# Altium schematic sheet Schematics.SchDoc
size 711 x 381 mm; SheetNumber: 1; SheetTotal: 1
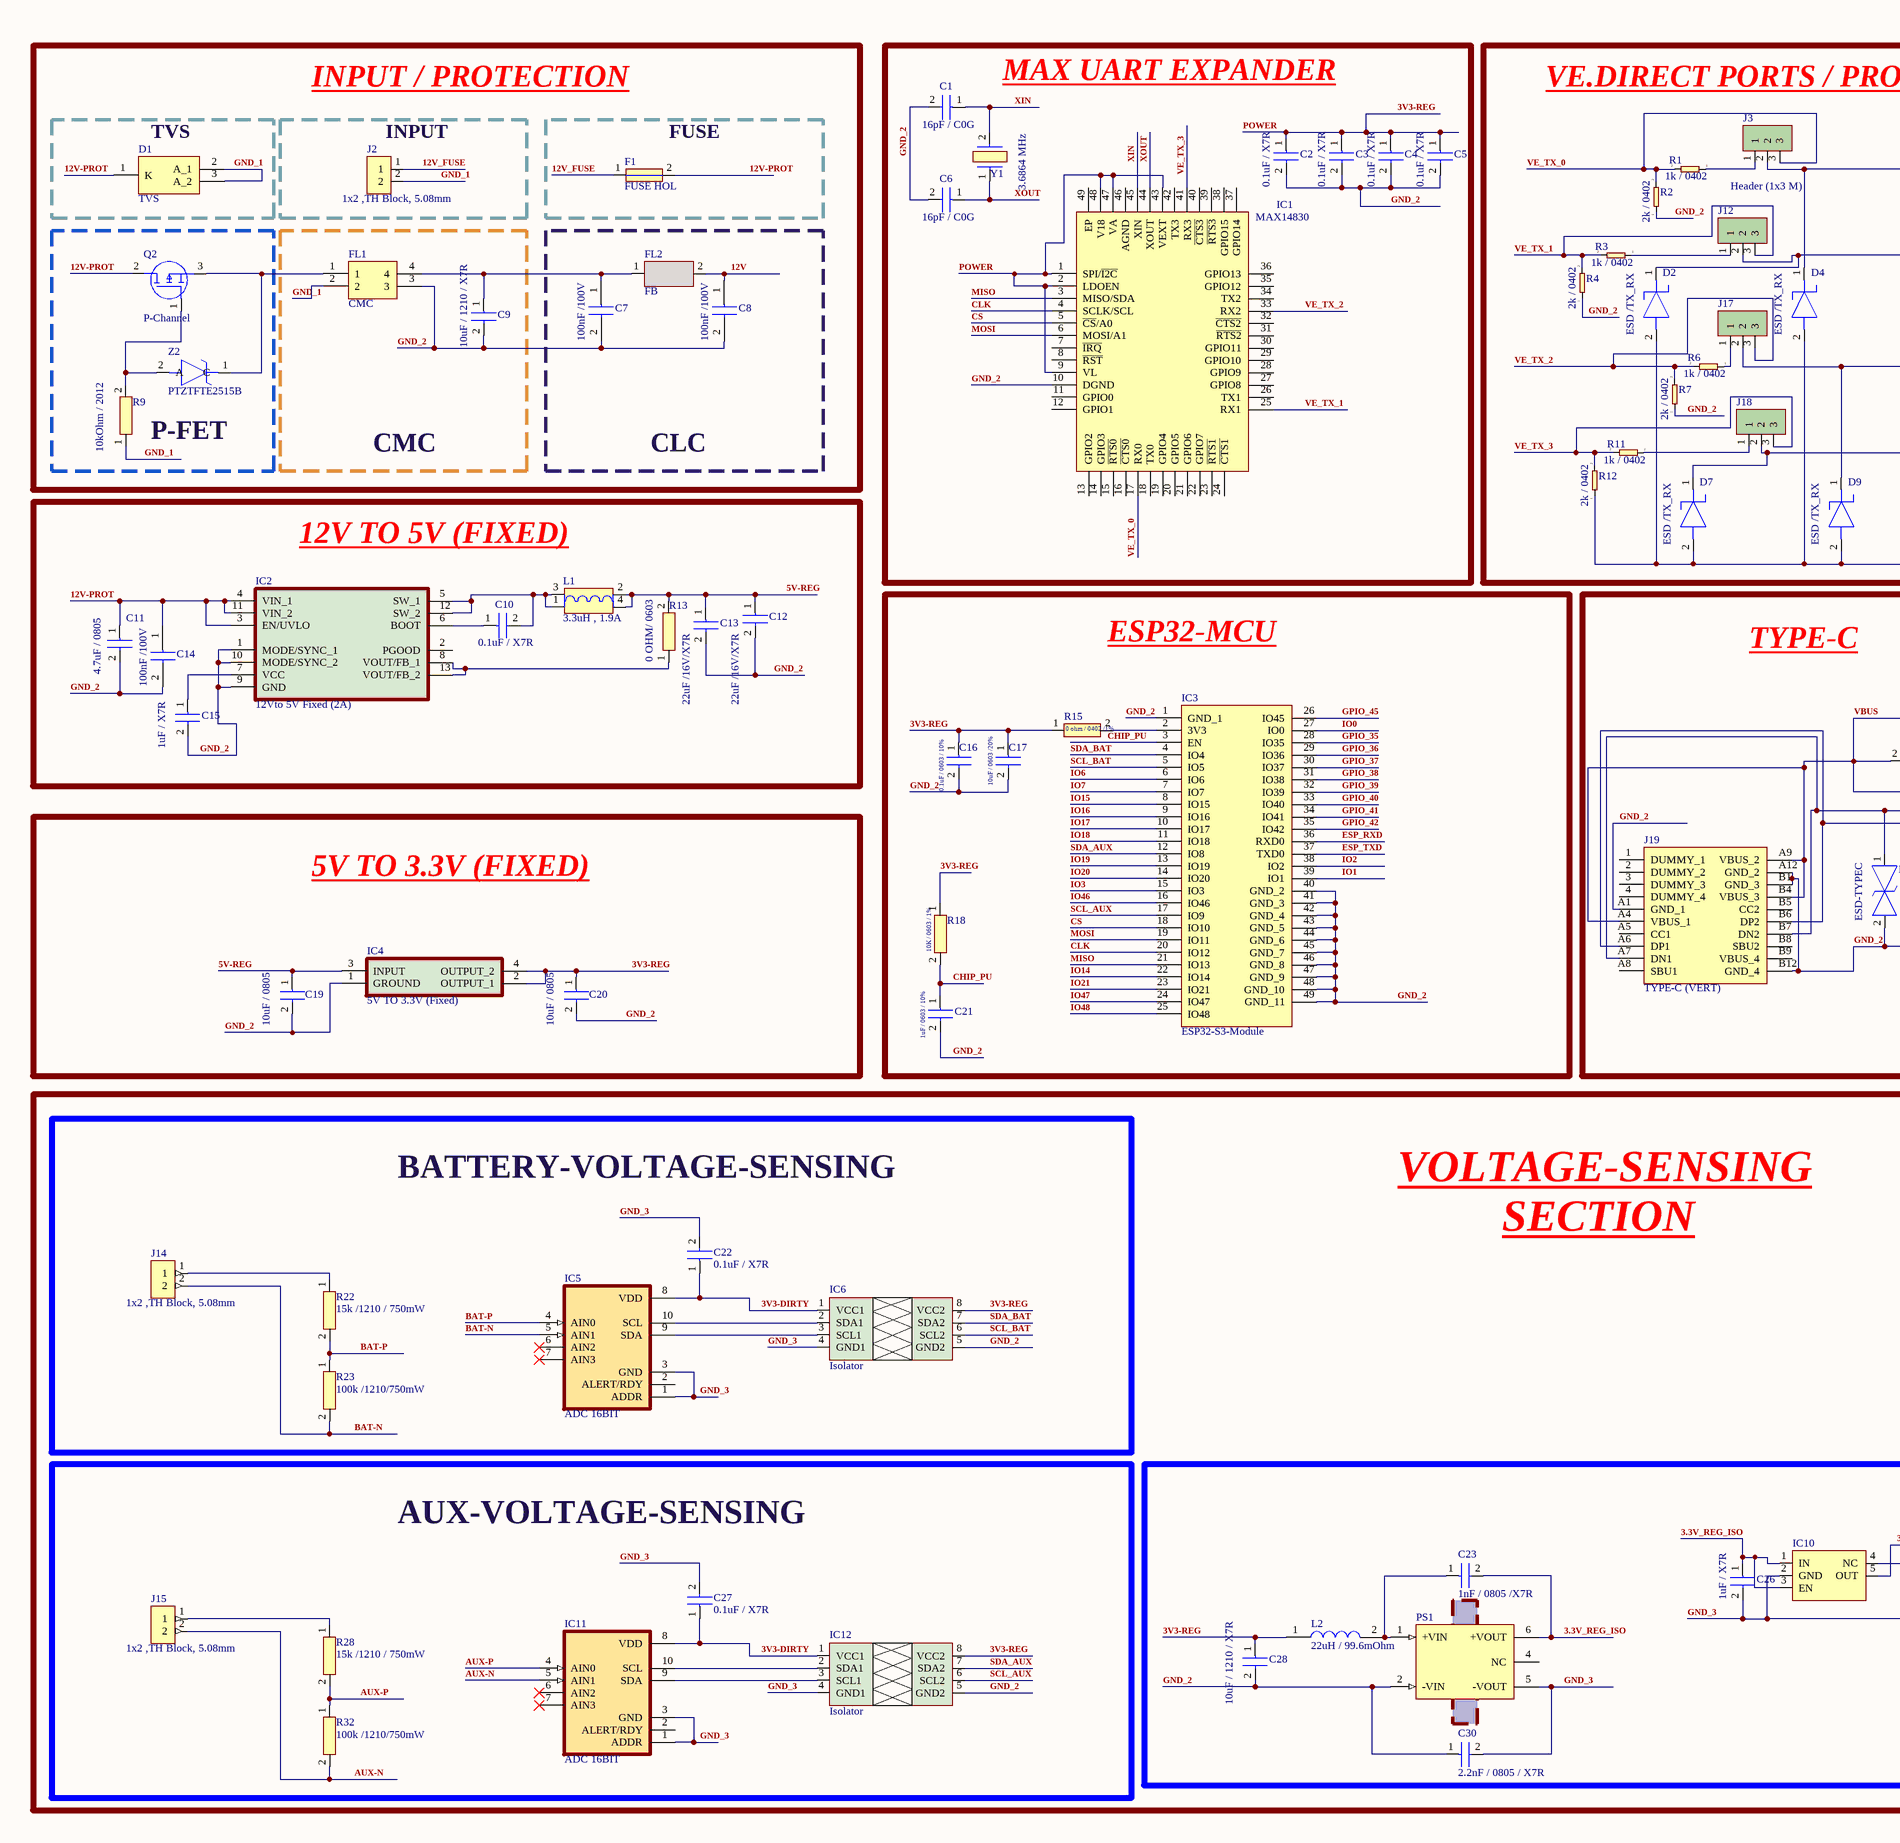
[diagram p0: Schematics.SchDoc, left]
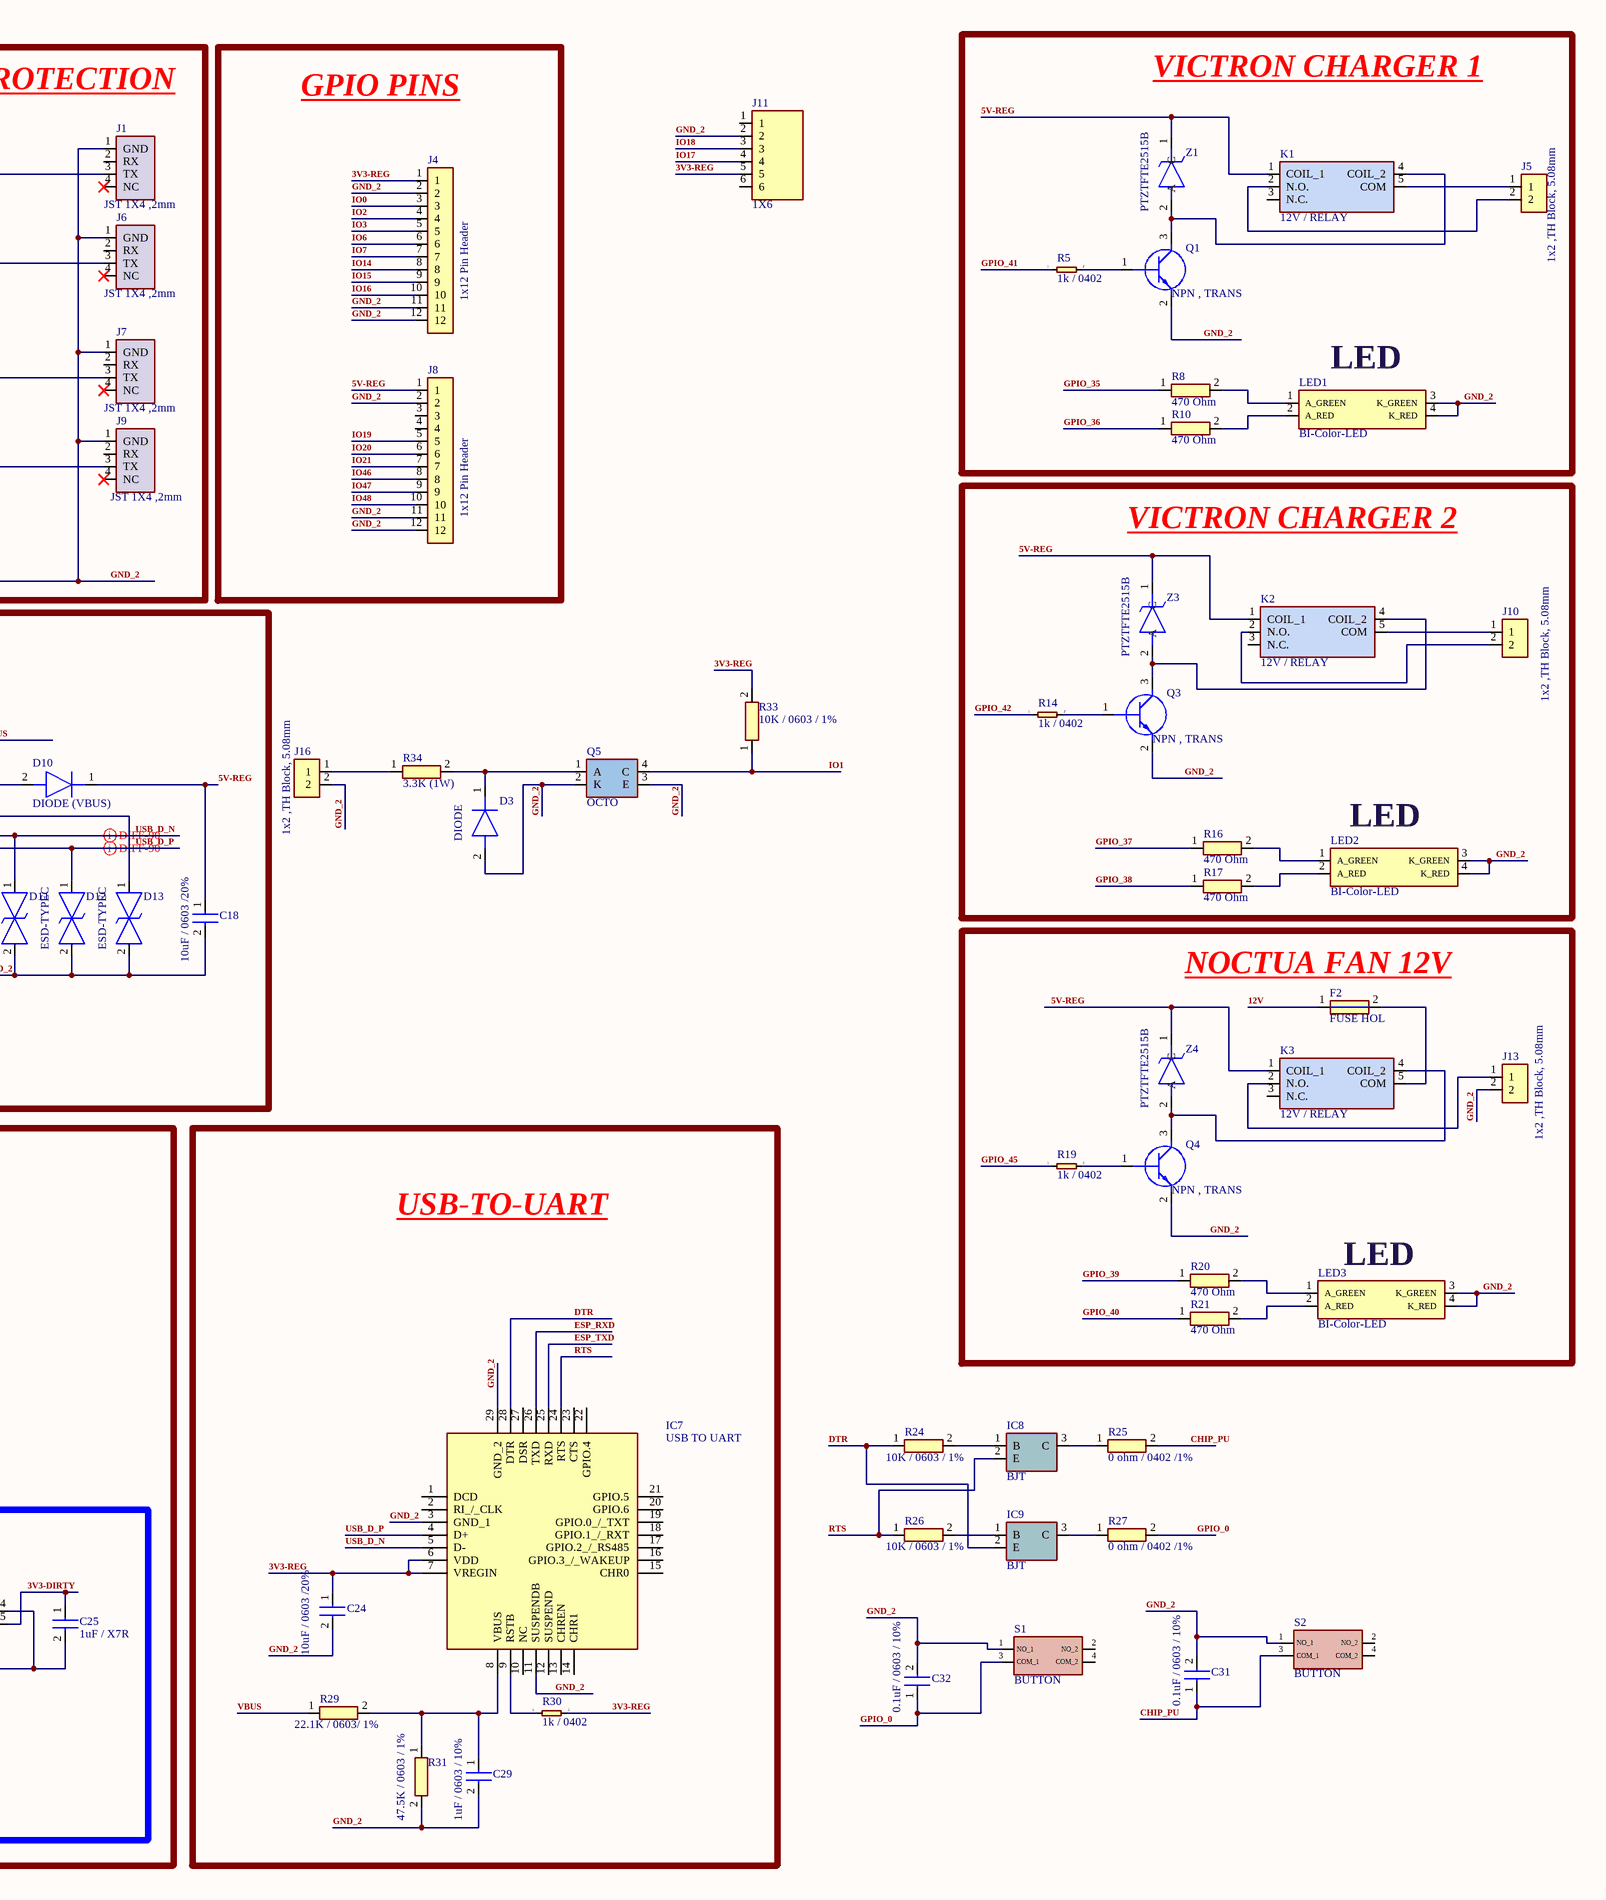
[diagram p1: Schematics.SchDoc, right]

## Parts
C1  16pF / C0G  [GJM1555C1H170JB01J]
C2  0.1uF / X7R  [MAJx16]
C3  0.1uF / X7R  [MAJx16]
C4  0.1uF / X7R  [MAJx16]
C5  0.1uF / X7R  [MAJx16]
C6  16pF / C0G  [GJM1555C1H170JB01J]
C7  100nF /100V  [CAPC1608X87N]
C8  100nF /100V  [CAPC1608X87N]
C9  10uF / 1210 / X7R  [CAPC3225X280N]
C10  0.1uF / X7R  [MAJx16]
C11  4.7uF / 0805  [CGA4J2NP01H223J125AA]
C12  22uF /16V/X7R  [CAPC3225X280N]
C13  22uF /16V/X7R  [CAPC3225X280N]
C14  100nF /100V  [CAPC1608X87N]
C15  1uF / X7R  [CAPC1608X100N]
C16  0.1uF / 0603 / 10%  [CAPC1608X90N]
C17  10uF / 0603 /20%  [CAPC1608X90N]
C18  10uF / 0603 /20%  [CAPC1608X90N]
C19  10uF / 0805  [CGA4J2NP01H223J125AA]
C20  10uF / 0805  [CGA4J2NP01H223J125AA]
C21  1uF / 0603 / 10%  [CAPC1608X90N]
C22  0.1uF / X7R  [MAJx16]
C23  1nF / 0805 /X7R  [C0805]
C24  10uF / 0603 /20%  [CAPC1608X90N]
C25  1uF / X7R  [CAPC1608X100N]
C26  1uF / X7R  [CAPC1608X100N]
C27  0.1uF / X7R  [MAJx16]
C28  10uF / 1210 / X7R  [CAPC3225X280N]
C29  1uF / 0603 / 10%  [CAPC1608X90N]
C30  2.2nF / 0805 / X7R  [C0805]
C31  0.1uF / 0603 / 10%  [CAPC1608X90N]
C32  0.1uF / 0603 / 10%  [CAPC1608X90N]
D1  TVS  [SLD8S36A]
D2  ESD /TX_RX  [PESD5V0S1ULQYL]
D3  DIODE  [SOD3716X125N]
D4  ESD /TX_RX  [PESD5V0S1ULQYL]
D7  ESD /TX_RX  [PESD5V0S1ULQYL]
D9  ESD /TX_RX  [PESD5V0S1ULQYL]
D10  DIODE (VBUS)  [SOD3716X125N]
D11  ESD-TYPEC  [LESD5D50CT1G]
D12  ESD-TYPEC  [LESD5D50CT1G]
D13  ESD-TYPEC  [LESD5D50CT1G]
F1  FUSE HOL  [01530008]
F2  FUSE HOL  [01530008]
FL1  CMC  [ACT45B1012PTL003]
FL2  FB  [BLM31KN102BH1L]
IC1  MAX14830  [QFN50P700X700X80-49N]
IC2  12Vto 5V Fixed (2A)  [LMR43620MC5RPERQ1]
IC3  ESP32-S3-Module  [ESP32S3WROOM1N8R2]
IC4  5V TO 3.3V (Fixed)  [SOT230P700X180-4N]
IC5  ADC 16BIT  [RUG-(R-PQFP-N10)]
IC6  Isolator  [SOIC127P600X175-8N]
IC7  USB TO UART  [QFN50P500X500X80-29N-D]
IC8  BJT  [L8050QLT1G]
IC9  BJT  [L8050QLT1G]
IC10  (no value)  [SOT95P280X145-5N]
IC11  ADC 16BIT  [RUG-(R-PQFP-N10)]
IC12  Isolator  [SOIC127P600X175-8N]
J1  JST 1X4 ,2mm  [SHDR4W50P0X200_1X4_990X600X450P]
J2  1x2 ,TH Block, 5.08mm  [1760510000]
J3  Header (1x3 M)  [HDRV3W63P0X254_1X3_762X250X950P]
J4  1x12 Pin Header  [HDRV12W68P0X254_1X12_3048X250X970P]
J5  1x2 ,TH Block, 5.08mm  [1760510000]
J6  JST 1X4 ,2mm  [SHDR4W50P0X200_1X4_990X600X450P]
J7  JST 1X4 ,2mm  [SHDR4W50P0X200_1X4_990X600X450P]
J8  1x12 Pin Header  [HDRV12W68P0X254_1X12_3048X250X970P]
J9  JST 1X4 ,2mm  [SHDR4W50P0X200_1X4_990X600X450P]
J10  1x2 ,TH Block, 5.08mm  [1760510000]
J11  1X6  [68001206HLF]
J12  Header (1x3 M)  [HDRV3W63P0X254_1X3_762X250X950P]  (value not drawn)
J13  1x2 ,TH Block, 5.08mm  [1760510000]
J14  1x2 ,TH Block, 5.08mm  [1760510000]
J15  1x2 ,TH Block, 5.08mm  [1760510000]
J16  1x2 ,TH Block, 5.08mm  [1760510000]
J17  Header (1x3 M)  [HDRV3W63P0X254_1X3_762X250X950P]  (value not drawn)
J18  Header (1x3 M)  [HDRV3W63P0X254_1X3_762X250X950P]  (value not drawn)
J19  TYPE-C (VERT)  [UJ20CVGSMTP16TR65]
K1  12V / RELAY  [ACQ131]
K2  12V / RELAY  [ACQ131]
K3  12V / RELAY  [ACQ131]
L1  3.3uH , 1.9A  [LQH43MN470K03L]
L2  22uH / 99.6mOhm  [XAL5030]
LED1  BI-Color-LED  [HSMFC163]
LED2  BI-Color-LED  [HSMFC163]
LED3  BI-Color-LED  [HSMFC163]
PS1  (no value)  [CONV_RB-3.33.3S]
Q1  NPN , TRANS  [SOT95P230X110-3N]
Q2  P-Channel  [FQD20N06TM]
Q3  NPN , TRANS  [SOT95P230X110-3N]
Q4  NPN , TRANS  [SOT95P230X110-3N]
Q5  OCTO  [SOP254P1016X436-4N]
R1  1k / 0402  [ERJ2RKD1004X]
R2  2k / 0402  [ERJPA2_(0402)]
R3  1k / 0402  [ERJ2RKD1004X]
R4  2k / 0402  [ERJPA2_(0402)]
R5  1k / 0402  [ERJ2RKD1004X]
R6  1k / 0402  [ERJ2RKD1004X]
R7  2k / 0402  [ERJPA2_(0402)]
R8  470 Ohm  [RESC2012X50N]
R9  10kOhm / 2012  [RESC2012X60N]
R10  470 Ohm  [RESC2012X50N]
R11  1k / 0402  [ERJ2RKD1004X]
R12  2k / 0402  [ERJPA2_(0402)]
R13  0 OHM/ 0603  [RESC1608X55N]
R14  1k / 0402  [ERJ2RKD1004X]
R15  0 ohm / 0402 /1%  [RESC1005X37N]
R16  470 Ohm  [RESC2012X50N]
R17  470 Ohm  [RESC2012X50N]
R18  10K / 0603 / 1%  [ERJP03_PA3_(0603)]
R19  1k / 0402  [ERJ2RKD1004X]
R20  470 Ohm  [RESC2012X50N]
R21  470 Ohm  [RESC2012X50N]
R22  15k /1210 / 750mW  [RESC3225X70N]
R23  100k /1210/750mW  [RESC3225X70N]
R24  10K / 0603 / 1%  [ERJP03_PA3_(0603)]
R25  0 ohm / 0402 /1%  [RESC1005X37N]
R26  10K / 0603 / 1%  [ERJP03_PA3_(0603)]
R27  0 ohm / 0402 /1%  [RESC1005X37N]
R28  15k /1210 / 750mW  [RESC3225X70N]
R29  22.1K / 0603/ 1%  [ERJP03_PA3_(0603)]
R30  1k / 0402  [ERJ2RKD1004X]
R31  47.5K / 0603 / 1%  [ERJ1GJJ2R4C]
R32  100k /1210/750mW  [RESC3225X70N]
R33  10K / 0603 / 1%  [ERJP03_PA3_(0603)]
R34  3.3K (1W)  [RESC2550X65N]
S1  BUTTON  [NTC013AT1JA160T]
S2  BUTTON  [NTC013AT1JA160T]
Y1  3.6864 MHz  [830030798]
Z1  PTZTFTE2515B  [PTZTFTE2515B]
Z2  PTZTFTE2515B  [PTZTFTE2515B]
Z3  PTZTFTE2515B  [PTZTFTE2515B]
Z4  PTZTFTE2515B  [PTZTFTE2515B]

## Blocks framed on the sheet
LED: J5 K1 LED1 Q1 R5 R8 R10 Z1
MAX UART EXPANDER: C1-C6 IC1 Y1
VE.DIRECT PORTS / PROTECTION: D2 D4 D7 D9 J1 J3 J6 J7 J9 J12 J17 J18 R1-R4 R6 R7 R11 R12
GPIO PINS: J4 J8
TVS: D1
INPUT: J2
FUSE: F1
P-FET: Q2 R9 Z2
CMC: C9 FL1
CLC: C7 C8 FL2
LED: J10 K2 LED2 Q3 R14 R16 R17 Z3
12V TO 5V (FIXED): C10-C15 IC2 L1 R13
ESP32-MCU: C16 C17 C21 IC3 R15 R18
TYPE-C: C18 D10-D13 J19
5V TO 3.3V (FIXED): C19 C20 IC4
LED: F2 J13 K3 LED3 Q4 R19-R21 Z4
BATTERY-VOLTAGE-SENSING: C22 IC5 IC6 J14 R22 R23
USB-TO-UART: C24 C29 IC7 R29-R31
AUX-VOLTAGE-SENSING: C27 IC11 IC12 J15 R28 R32

## Nets
3.3V_REG_ISO: C23.2 C26.1 IC10.1(IN) IC10.3(EN) PS1.6(+VOUT)
3V3-DIRTY: C22.1 C25.1 C27.1 IC5.8(VDD) IC6.1(VCC1) IC10.5(OUT) IC11.8(VDD) IC12.1(VCC1)
3V3-REG: C2.1 C3.1 C4.1 C5.1 C16.1 C17.1 C20.1 C24.1 C28.1 IC1.1(SPI/~{I2C}) IC1.2(LDOEN) IC1.9(VL) IC1.43(VEXT) IC1.47(VA) IC1.48(V18) IC4.2(OUTPUT_1) IC4.4(OUTPUT_2) IC6.8(VCC2) IC7.6(VDD) IC7.7(VREGIN) IC12.8(VCC2) J4.1 J11.5 L2.1 R15.1 R18.1 R30.2 R33.2  [also labelled POWER]
5V-REG: C12.1 C13.1 C18.1 C19.1 D10.1(K) IC4.3(INPUT) J8.1 K1.1(COIL_1) K2.1(COIL_1) K3.1(COIL_1) L1.2 L1.4 R13.2 Z1.1(C) Z3.1(C) Z4.1(C)
12V: C8.1 F2.1 FL2.2
12V-PROT: C11.1 C14.1 D1.1(K) F1.2 IC2.3(EN/UVLO) IC2.4(VIN_1) IC2.11(VIN_2) Q2.2(D)
12V_FUSE: F1.1 J2.1
AUX-N: IC11.5(AIN1) J15.2 R32.2
AUX-P: IC11.4(AIN0) R28.2 R32.1
BAT-N: IC5.5(AIN1) J14.2 R23.2
BAT-P: IC5.4(AIN0) R22.2 R23.1
CHIP_PU: C21.1 C31.1 IC3.3(EN) R18.2 R25.2 S2.3(COM_1)
CLK: IC1.4(SCLK/SCL) IC3.20(IO12)
CS: IC1.5(~{CS}/A0) IC3.18(IO10)
DTR: IC7.28(DTR) IC9.2(E) R24.1
ESP_RXD: IC3.36(RXD0) IC7.26(TXD)
ESP_TXD: IC3.37(TXD0) IC7.25(RXD)
GND_1: D1.2(A_1) D1.3(A_2) FL1.2 J2.2 R9.1
GND_2: C1.2 C2.2 C3.2 C4.2 C5.2 C6.2 C7.2 C8.2 C9.2 C11.2 C12.2 C13.2 C14.2 C15.2 C16.2 C17.2 C18.2 C19.2 C20.2 C21.2 C24.2 C28.2 C29.2 C30.1 C31.2 C32.2 D2.2(A) D3.2(A) D4.2(A) D7.2(A) D9.2(A) D11.2 D12.2 D13.2 FL1.3 IC1.10(DGND) IC2.1(MODE/SYNC_1) IC2.9(GND) IC2.10(MODE/SYNC_2) IC3.1(GND_1) IC3.40(GND_2) IC3.41(GND_3) IC3.42(GND_4) IC3.43(GND_5) IC3.44(GND_6) IC3.45(GND_7) IC3.46(GND_8) IC3.47(GND_9) IC3.48(GND_10) IC3.49(GND_11) IC4.1(GROUND) IC6.5(GND2) IC7.3(GND_1) IC7.11(SUSPENDB) IC7.29(GND_2) IC12.5(GND2) J1.1(GND) J4.2 J4.11 J4.12 J6.1(GND) J7.1(GND) J8.2 J8.11 J8.12 J9.1(GND) J11.2 J13.2 J16.2 J19.A1(GND_1) J19.A12(GND_2) J19.B1(GND_3) J19.B12(GND_4) LED1.3(K_GREEN) LED1.4(K_RED) LED2.3(K_GREEN) LED2.4(K_RED) LED3.3(K_GREEN) LED3.4(K_RED) PS1.2(-VIN) Q1.2(E) Q3.2(E) Q4.2(E) Q5.2(K) Q5.3(E) R2.1 R4.1 R7.1 R12.1 R31.2 S1.1(NO_1) S2.1(NO_1)
GND_3: C22.2 C25.2 C26.2 C27.2 C30.2 IC5.1(ADDR) IC5.3(GND) IC6.4(GND1) IC10.2(GND) IC10.4(NC) IC11.1(ADDR) IC11.3(GND) IC12.4(GND1) PS1.5(-VOUT)
GPIO_0: C32.1 R27.2 S1.3(COM_1)
GPIO_35: IC3.28(IO35) R8.1
GPIO_36: IC3.29(IO36) R10.1
GPIO_37: IC3.30(IO37) R16.1
GPIO_38: IC3.31(IO38) R17.1
GPIO_39: IC3.32(IO39) R20.1
GPIO_40: IC3.33(IO40) R21.1
GPIO_41: IC3.34(IO41) R5.1
GPIO_42: IC3.35(IO42) R14.1
GPIO_45: IC3.26(IO45) R19.1
IO0: IC3.27(IO0) J4.3
IO1: IC3.39(IO1) Q5.4(C) R33.1
IO2: IC3.38(IO2) J4.4
IO3: IC3.15(IO3) J4.5
IO6: IC3.6(IO6) J4.6
IO7: IC3.7(IO7) J4.7
IO14: IC3.22(IO14) J4.8
IO15: IC3.8(IO15) J4.9
IO16: IC3.9(IO16) J4.10
IO17: IC3.10(IO17) J11.4
IO18: IC3.11(IO18) J11.3
IO19: IC3.13(IO19) J8.5
IO20: IC3.14(IO20) J8.6
IO21: IC3.23(IO21) J8.7
IO46: IC3.16(IO46) J8.8
IO47: IC3.24(IO47) J8.9
IO48: IC3.25(IO48) J8.10
MISO: IC1.3(MISO/SDA) IC3.21(IO13)
MOSI: IC1.6(MOSI/A1) IC3.19(IO11)
RTS: IC7.24(RTS) IC8.2(E) R26.1
SCL_AUX: IC3.17(IO9) IC12.6(SCL2)
SCL_BAT: IC3.5(IO5) IC6.6(SCL2)
SDA_AUX: IC3.12(IO8) IC12.7(SDA2)
SDA_BAT: IC3.4(IO4) IC6.7(SDA2)
USB_D_N: D11.1 IC7.5(D-) J19.A7(DN1) J19.B7(DN2)
USB_D_P: D12.1 IC7.4(D+) J19.A6(DP1) J19.B6(DP2)
VBUS: D10.2(A) D13.1 J19.A4(VBUS_1) J19.A9(VBUS_2) J19.B4(VBUS_3) R29.1
VE_TX_0: IC1.17(RX0) J3.3 R1.2 R2.2
VE_TX_1: IC1.25(RX1) J12.3 R3.2 R4.2
VE_TX_2: IC1.33(RX2) J17.3 R6.2 R7.2
VE_TX_3: IC1.41(RX3) J18.3 R11.2 R12.2
XIN: C1.1 IC1.45(XIN) Y1.2
XOUT: C6.1 IC1.44(XOUT) Y1.1
NetC7_1: C7.1 C9.1 FL1.4 FL2.1
NetC10_1: C10.1 IC2.6(BOOT)
NetC10_2: C10.2 IC2.5(SW_1) IC2.12(SW_2) L1.1 L1.3
NetC15_1: C15.1 IC2.7(VCC)
NetC23_1: C23.1 L2.2 PS1.1(+VIN)
NetC29_1: C29.1 IC7.8(VBUS) R29.2 R31.1
NetD2_1: D2.1(K) J6.3(TX) J12.2
NetD3_1: D3.1(K) Q5.1(A) R34.2
NetD4_1: D4.1(K) J1.3(TX) J3.2
NetD7_1: D7.1(K) J9.3(TX) J18.2
NetD9_1: D9.1(K) J7.3(TX) J17.2
NetF2_2: F2.2 K3.5(COM)
NetFL1_1: FL1.1 Q2.3(S) Z2.1(C)
NetIC2_8: IC2.8(VOUT/FB_1) IC2.13(VOUT/FB_2) R13.1
NetIC3_2: IC3.2(3V3) R15.2
NetIC5_9: IC5.9(SDA) IC6.3(SCL1)
NetIC5_10: IC5.10(SCL) IC6.2(SDA1)
NetIC7_9: IC7.9(RSTB) R30.1
NetIC8_1: IC8.1(B) R24.2
NetIC8_3: IC8.3(C) R25.1
NetIC9_1: IC9.1(B) R26.2
NetIC9_3: IC9.3(C) R27.1
NetIC11_9: IC11.9(SDA) IC12.3(SCL1)
NetIC11_10: IC11.10(SCL) IC12.2(SDA1)
NetJ3_1: J3.1 R1.1
NetJ5_1: J5.1 K1.5(COM)
NetJ5_2: J5.2 K1.2(N.O.)
NetJ10_1: J10.1 K2.5(COM)
NetJ10_2: J10.2 K2.2(N.O.)
NetJ12_1: J12.1 R3.1
NetJ13_1: J13.1 K3.2(N.O.)
NetJ14_1: J14.1 R22.1
NetJ15_1: J15.1 R28.1
NetJ16_1: J16.1 R34.1
NetJ17_1: J17.1 R6.1
NetJ18_1: J18.1 R11.1
NetK1_4: K1.4(COIL_2) Q1.3(C) Z1.2(A)
NetK2_4: K2.4(COIL_2) Q3.3(C) Z3.2(A)
NetK3_4: K3.4(COIL_2) Q4.3(C) Z4.2(A)
NetLED1_1: LED1.1(A_GREEN) R8.2
NetLED1_2: LED1.2(A_RED) R10.2
NetLED2_1: LED2.1(A_GREEN) R16.2
NetLED2_2: LED2.2(A_RED) R17.2
NetLED3_1: LED3.1(A_GREEN) R20.2
NetLED3_2: LED3.2(A_RED) R21.2
NetQ1_1: Q1.1(B) R5.2
NetQ2_1: Q2.1(G) R9.2 Z2.2(A)
NetQ3_1: Q3.1(B) R14.2
NetQ4_1: Q4.1(B) R19.2

Not connected (* = marked no-connect by the designer): IC1 7(~{IRQ}) 8(~{RST}) 11(GPIO0) 12(GPIO1) 13(GPIO2) 14(GPIO3) 15(~{RTS0}) 16(~{CTS0}) 18(TX0) 19(GPIO4) 20(GPIO5) 21(GPIO6) 22(GPIO7) 23(~{RTS1}) 24(~{CTS1}) 26(TX1) 27(GPIO8) 28(GPIO9) 29(GPIO10) 30(GPIO11) 31(~{RTS2}) 32(~{CTS2}) 34(TX2) 35(GPIO12) 36(GPIO13) 37(GPIO14) 38(GPIO15) 39(~{RTS3}) 40(~{CTS3}) 42(TX3) 46(AGND) 49(EP); IC2 2(PGOOD); IC5 2(ALERT/RDY) 6(AIN2)* 7(AIN3)*; IC7 1(DCD) 2(RI_/_CLK) 10(NC) 12(SUSPEND) 13(CHREN) 14(CHR1) 15(CHR0) 16(GPIO.3_/_WAKEUP) 17(GPIO.2_/_RS485) 18(GPIO.1_/_RXT) 19(GPIO.0_/_TXT) 20(GPIO.6) 21(GPIO.5) 22(GPIO.4) 23(CTS) 27(DSR); IC11 2(ALERT/RDY) 6(AIN2)* 7(AIN3)*; J1 2(RX) 4(NC)*; J6 2(RX) 4(NC)*; J7 2(RX) 4(NC)*; J8 3 4; J9 2(RX) 4(NC)*; J11 1 6; J19 1(DUMMY_1) 2(DUMMY_2) 3(DUMMY_3) 4(DUMMY_4) A5(CC1) A8(SBU1) B5(CC2) B8(SBU2) B9(VBUS_4); K1 3(N.C.); K2 3(N.C.); K3 3(N.C.); PS1 4(NC); S1 2(NO_2) 4(COM_2); S2 2(NO_2) 4(COM_2)

## Layout directives
differential pair; differential pair class 90-OHM: USB_D_N, USB_D_P

## Notes on the sheet
- VICTRON CHARGER 1
- INPUT / PROTECTION
- VICTRON CHARGER 2
- (near F2) NOCTUA FAN 12V
- VOLTAGE-SENSING
- SECTION

## Library data of the parts
C1 C6 = GJM1555C1H160FB01J: Capacitor; Manufacturer_Name: Murata Electronics; Datasheet Link: https://search.murata.co.jp/Ceramy/image/img/A01X/G101/ENG/GJM1555C1H160FB01-01A.pdf; Height: 0.55mm; Manufacturer_Part_Number: GJM1555C1H160FB01J; Mouser Part Number: 81-GJM1555C1H160FB1J; Mouser Price/Stock: https://www.mouser.co.uk/ProductDetail/Murata-Electronics/GJM1555C1H160FB01J?qs=QzBtWTOodeWJ9M0Fp%2F2Qlw%3D%3D
C2-C5 C10 C22 C27 = MAJCU168BB7104KTEA01: Capacitor; Manufacturer_Name: TAIYO YUDEN; Datasheet Link: https://ds.yuden.co.jp/TYCOMPAS/or/detail?pn=MAJCU168BB7104KTEA01; Height: 0.8mm; Manufacturer_Part_Number: MAJCU168BB7104KTEA01
C7 C8 C14 = C0603C104J1RACAUTO7411: Multilayer Ceramic Capacitors MLCC - SMD/SMT 100V 100000pF 5% X7R 1608 AEC-Q200; Manufacturer_Name: KEMET; Datasheet Link: https://cz.mouser.com/datasheet/2/447/KEM_C1023_X7R_AUTO_SMD-3316698.pdf; Height: 0.87mm; Manufacturer_Part_Number: C0603C104J1RACAUTO7411; Mouser Part Number: 80-C0603C104J1RAUTO7; Mouser Price/Stock: https://www.mouser.co.uk/ProductDetail/KEMET/C0603C104J1RACAUTO7411?qs=ulEaXIWI0c%252BJFv1YOR%252BSZg%3D%3D
C9 C28 = CGA6P1X7R2A106K250AC: Capacitor; Manufacturer_Name: TDK; Datasheet Link: https://product.tdk.com/info/en/catalog/datasheets/mlcc_automotive_general_en.pdf; Height: 2.8mm; Manufacturer_Part_Number: CGA6P1X7R2A106K250AC
C11 = CGA4J3X7R1C475K125AE: Capacitor; Manufacturer_Name: TDK; Datasheet Link: http://docs-europe.electrocomponents.com/webdocs/14e9/0900766b814e9125.pdf; Height: 1.45mm; Manufacturer_Part_Number: CGA4J3X7R1C475K125AE; Mouser Part Number: 810-CGA4J3X7R1C475KS; Mouser Price/Stock: https://www.mouser.co.uk/ProductDetail/TDK/CGA4J3X7R1C475K125AE?qs=FxQuwy19cyADXX788CagRA%3D%3D; Arrow Part Number: CGA4J3X7R1C475K125AE; Arrow Price/Stock: https://www.arrow.com/en/products/cga4j3x7r1c475k125ae/tdk
C12 C13 = CGA6P1X7R1C226M250AC: Capacitor; Manufacturer_Name: TDK; Datasheet Link: https://product.tdk.com/system/files/dam/doc/product/capacitor/ceramic/mlcc/catalog/mlcc_automotive_general_en.pdf; Height: 2.8mm; Manufacturer_Part_Number: CGA6P1X7R1C226M250AC; Mouser Part Number: 810-CGA6P1X7R1C226M; Mouser Price/Stock: https://www.mouser.co.uk/ProductDetail/TDK/CGA6P1X7R1C226M250AC?qs=NRhsANhppD%2FAe7owpb9Z2A%3D%3D; Arrow Part Number: CGA6P1X7R1C226M250AC; Arrow Price/Stock: https://www.arrow.com/en/products/cga6p1x7r1c226m250ac/tdk
C15 C25 C26 = CL10B105KB9VPNC: Capacitor; Manufacturer_Name: SAMSUNG; Datasheet Link: https://www.mouser.com/datasheet/2/585/MLCC_Automotive-1837966.pdf; Height: 1mm; Manufacturer_Part_Number: CL10B105KB9VPNC; Mouser Part Number: 187-CL10B105KB9VPNC; Mouser Price/Stock: https://www.mouser.co.uk/ProductDetail/Samsung-Electro-Mechanics/CL10B105KB9VPNC?qs=3Rah4i%252BhyCFE9VrNkitckQ%3D%3D
C16 C31 C32 = CGA3E2X7R1E104K080AA: Multilayer Ceramic Capacitors MLCC - SMD/SMT CGA 0603 25V 0.1uF X7R 10% AEC-Q200; Manufacturer_Name: TDK; Datasheet Link: http://docs-europe.electrocomponents.com/webdocs/14e9/0900766b814e9125.pdf; Height: 0.9mm; Manufacturer_Part_Number: CGA3E2X7R1E104K080AA; Mouser Part Number: 810-CGA3E2X7R1E104K; Mouser Price/Stock: https://www.mouser.co.uk/ProductDetail/TDK/CGA3E2X7R1E104K080AA?qs=NRhsANhppD%2Fm7%2FOmmsm0vg%3D%3D; Arrow Part Number: CGA3E2X7R1E104K080AA; Arrow Price/Stock: https://www.arrow.com/en/products/cga3e2x7r1e104k080aa/tdk?utm_currency=USD&region=nac
C17 C18 C24 = GRT188R61E106ME13D: Multilayer Ceramic Capacitors MLCC - SMD/SMT 10 uF 25 VDC 20% 0603 X5R AEC-Q200; Manufacturer_Name: Murata Electronics; Datasheet Link: https://search.murata.co.jp/Ceramy/image/img/A01X/G101/ENG/GRT188R61E106ME13-01A.pdf; Height: 0.9mm; Manufacturer_Part_Number: GRT188R61E106ME13D; Mouser Part Number: 81-GRT188R61E106ME3D; Mouser Price/Stock: https://www.mouser.co.uk/ProductDetail/Murata-Electronics/GRT188R61E106ME13D?qs=drgMNd%252BkGPNNTFaFP8SYQA%3D%3D; Arrow Part Number: GRT188R61E106ME13D; Arrow Price/Stock: https://www.arrow.com/en/products/grt188r61e106me13d/murata-manufacturing?region=nac
C19 C20 = CGA4J1X7S1C106M125AE: Capacitor; Manufacturer_Name: TDK; Datasheet Link: http://docs-europe.electrocomponents.com/webdocs/14e9/0900766b814e9125.pdf; Height: 1.45mm; Manufacturer_Part_Number: CGA4J1X7S1C106M125AE; Mouser Part Number: 810-CGA4J1X7S1C106MA; Mouser Price/Stock: https://www.mouser.co.uk/ProductDetail/TDK/CGA4J1X7S1C106M125AE?qs=nQSIdc08i%252BcCPp0JpxJc5Q%3D%3D; Arrow Part Number: CGA4J1X7S1C106M125AE; Arrow Price/Stock: https://www.arrow.com/en/products/cga4j1x7s1c106m125ae/tdk?utm_currency=USD&region=nac
C21 C29 = CGA3E1X7R1E105K080AE: Multilayer Ceramic Capacitors MLCC - SMD/SMT SOFT 0603 25V 1uF X7R 10% AEC-Q200; Manufacturer_Name: TDK; Datasheet Link: http://docs-europe.electrocomponents.com/webdocs/14e9/0900766b814e9125.pdf; Height: 0.9mm; Manufacturer_Part_Number: CGA3E1X7R1E105K080AE; Mouser Part Number: 810-CGA3E1X7R1E105KA; Mouser Price/Stock: https://www.mouser.co.uk/ProductDetail/TDK/CGA3E1X7R1E105K080AE?qs=nQSIdc08i%252Bcymysfik8KxA%3D%3D; Arrow Part Number: CGA3E1X7R1E105K080AE; Arrow Price/Stock: https://www.arrow.com/en/products/cga3e1x7r1e105k080ae/tdk
C23 = C0805J222K1RACAUTO_1: Multilayer Ceramic Capacitors MLCC - SMD/SMT 100V 1000pF X7R 0805 20% AEC-Q200; Manufacturer_Name: KEMET; Datasheet Link: https://content.kemet.com/datasheets/KEM_C1012_X7R_OPENMODE_SMD.pdf; Height: 1.1mm; Manufacturer_Part_Number: C0805J222K1RACAUTO; Mouser Part Number: 80-C0805J222K1RAUTO; Mouser Price/Stock: https://www.mouser.co.uk/ProductDetail/KEMET/C0805J222K1RACAUTO?qs=ds50AKTGxA8FpM89MhHcBQ%3D%3D
C30 = C0805J222K1RACAUTO: Multilayer Ceramic Capacitors MLCC - SMD/SMT 100V 2200pF X7R 0805 10% AEC-Q200; Manufacturer_Name: KEMET; Datasheet Link: https://content.kemet.com/datasheets/KEM_C1012_X7R_OPENMODE_SMD.pdf; Height: 1.1mm; Manufacturer_Part_Number: C0805J222K1RACAUTO; Mouser Part Number: 80-C0805J222K1RAUTO; Mouser Price/Stock: https://www.mouser.co.uk/ProductDetail/KEMET/C0805J222K1RACAUTO?qs=ds50AKTGxA8FpM89MhHcBQ%3D%3D
D1 = SLD8S36A: TVS Diode (Uni-directional); Manufacturer_Name: LITTELFUSE; Datasheet Link: https://datasheet.datasheetarchive.com/originals/distributors/DKDS41/DSANUWW0026090.pdf; Height: 4.78mm; Manufacturer_Part_Number: SLD8S36A; Mouser Part Number: 576-SLD8S36A; Mouser Price/Stock: https://www.mouser.co.uk/ProductDetail/Littelfuse/SLD8S36A?qs=CoLE6mUHV0srESI5Dw%2FcKA%3D%3D; Arrow Part Number: SLD8S36A; Arrow Price/Stock: https://www.arrow.com/en/products/sld8s36a/littelfuse?region=nac
D2 D4 D7 D9 = PESD5V0S1UL-QYL: Diode ESD (Uni-directional); Manufacturer_Name: Nexperia; Datasheet Link: https://www.digikey.com/en/products/detail/nexperia-usa-inc/PESD5V0S1UL-QYL/17748204?msockid=3bdc366bbe0663d83c1223c0bf3662a6; Height: 0.5mm; Manufacturer_Part_Number: PESD5V0S1UL-QYL; Mouser Part Number: 771-PESD5V0S1UL-QYL; Mouser Price/Stock: https://www.mouser.co.uk/ProductDetail/Nexperia/PESD5V0S1UL-QYL?qs=rQFj71Wb1eWaKKPWHDNuZA%3D%3D; Arrow Part Number: PESD5V0S1UL-QYL; Arrow Price/Stock: https://www.arrow.com/en/products/pesd5v0s1ul-qyl/nexperia?utm_currency=USD&region=nac
D3 = 1N5819HW-7-F: Manufacturer_Name: Multicomp Pro; Datasheet Link: http://www.farnell.com/datasheets/1693720.pdf; Height: 1.25mm; Manufacturer_Part_Number: 1N5819HW-7-F
D10 = 1N5819HW-7-F: Diode; Manufacturer_Name: Multicomp Pro; Datasheet Link: http://www.farnell.com/datasheets/1693720.pdf; Height: 1.25mm; Manufacturer_Part_Number: 1N5819HW-7-F
D11-D13 = LESD5D5.0CT1G: TVS Diode (Bi-directional); Manufacturer_Name: LRC; Height: 0.7mm; Manufacturer_Part_Number: LESD5D5.0CT1G
F1 F2 = 01530008Z: Fuse Holder 15 A 32V 1 Circuit Blade Through Hole; Manufacturer_Name: LITTELFUSE; Datasheet Link: http://www.littelfuse.com/data/en/data_sheets/153_pcmount.pdf; Manufacturer_Part_Number: 01530008Z; Mouser Part Number: 576-01530008Z; Mouser Price/Stock: https://www.mouser.co.uk/ProductDetail/Littelfuse/01530008Z?qs=gu7KAQ731UQHzmSA1Of2BQ%3D%3D; Arrow Part Number: 01530008Z; Arrow Price/Stock: https://www.arrow.com/en/products/01530008z/littelfuse?utm_currency=USD&region=europe
FL1 = ACT45B-510-2P-TL003: Filter; Manufacturer_Name: TDK; Datasheet Link: https://product.tdk.com/system/files/dam/doc/product/emc/emc/cmf_cmc/catalog/cmf_automotive_signal_act45b_en.pdf; Height: 3mm; Manufacturer_Part_Number: ACT45B-510-2P-TL003; Mouser Part Number: 810-ACT45B5102PTL003; Mouser Price/Stock: https://www.mouser.co.uk/ProductDetail/TDK/ACT45B-510-2P-TL003?qs=U1cgCdF9Le9LCroNYLqljw%3D%3D; Arrow Part Number: ACT45B-510-2P-TL003; Arrow Price/Stock: https://www.arrow.com/en/products/act45b-510-2p-tl003/tdk?utm_currency=USD&region=nac
FL2 = BLM31KN601SZ1L: Filter; Manufacturer_Name: Murata Electronics; Datasheet Link: https://www.murata.com/en-us/products/productdetail?partno=BLM31KN601SZ1%23; Height: 1.8mm; Manufacturer_Part_Number: BLM31KN601SZ1L; Mouser Part Number: 81-BLM31KN601SZ1L; Mouser Price/Stock: https://www.mouser.co.uk/ProductDetail/Murata-Electronics/BLM31KN601SZ1L?qs=EU6FO9ffTwfBlPk3K10OmA%3D%3D; Arrow Part Number: BLM31KN601SZ1L; Arrow Price/Stock: https://www.arrow.com/en/products/blm31kn601sz1l/murata-manufacturing?region=nac
IC1 = MAX14830ETM+: UART Interface IC Quad Serial UART; Manufacturer_Name: Analog Devices; Datasheet Link: http://datasheets.maximintegrated.com/en/ds/MAX14830.pdf; Height: 0.8mm; Manufacturer_Part_Number: MAX14830ETM+; Mouser Part Number: 700-MAX14830ETM+; Mouser Price/Stock: https://www.mouser.co.uk/ProductDetail/Analog-Devices-Maxim-Integrated/MAX14830ETM%2b?qs=pOU3usejv6ftQfmydKKFTw%3D%3D; Arrow Part Number: MAX14830ETM+; Arrow Price/Stock: https://www.arrow.com/en/products/max14830etm/analog-devices?region=europe
IC2 = LMR43620MSC5RPERQ1: Integrated Circuit; Manufacturer_Name: Texas Components; Datasheet Link: https://www.ti.com.cn/lit/ds/symlink/lmr43610-q1.pdf?ts=1642667065002&ref_url=https%253A%252F%252Fwww.ti.com.cn%252Fproduct%252Fcn%252FLMR43610-Q1; Manufacturer_Part_Number: LMR43620MSC5RPERQ1
IC3 = ESP32-S3-WROOM-1-N8: WiFi 802.11a/b/g/n, Bluetooth v5.0 Transceiver Module 2.4GHz PCB Trace; Manufacturer_Name: Espressif Systems; Datasheet Link: https://www.espressif.com/sites/default/files/documentation/esp32-s3-wroom-1_wroom-1u_datasheet_en.pdf; Height: 3.25mm; Manufacturer_Part_Number: ESP32-S3-WROOM-1-N8; Mouser Part Number: 356-ESP32-S3WROOM1N8; Mouser Price/Stock: https://www.mouser.co.uk/ProductDetail/Espressif-Systems/ESP32-S3-WROOM-1-N8?qs=Wj%2FVkw3K%252BMC1mq0KGPvoSQ%3D%3D
IC4 = NCV1117ST33T3G: Integrated Circuit; Manufacturer_Name: onsemi; Datasheet Link: https://www.onsemi.com/pub/Collateral/NCP1117-D.PDF; Height: 1.8mm; Manufacturer_Part_Number: NCV1117ST33T3G; Mouser Part Number: 863-NCV1117ST33T3G; Mouser Price/Stock: https://www.mouser.co.uk/ProductDetail/onsemi/NCV1117ST33T3G?qs=8sOby8ZxZLHgqg5CFzeqiA%3D%3D; Arrow Part Number: NCV1117ST33T3G; Arrow Price/Stock: https://www.arrow.com/en/products/ncv1117st33t3g/on-semiconductor?utm_currency=USD&region=europe
IC5 IC11 = ADS1115IRUGT: 16 Bit Analog to Digital Converter 2, 4 Input 1 Sigma-Delta 10-X2QFN (2x1.5); Manufacturer_Name: Texas Instruments; Datasheet Link: https://datasheet.datasheetarchive.com/originals/distributors/SFDatasheet-7/sf-000145394.pdf; Manufacturer_Part_Number: ADS1115IRUGT; Mouser Part Number: 595-ADS1115IRUGT; Mouser Price/Stock: https://www.mouser.co.uk/ProductDetail/Texas-Instruments/ADS1115IRUGT?qs=IK5e5L0zOXg6IhmdxHtCUQ%3D%3D; Arrow Part Number: ADS1115IRUGT; Arrow Price/Stock: https://www.arrow.com/en/products/ads1115irugt/texas-instruments?utm_currency=USD&region=nac
IC6 IC12 = ISO1540DR: Integrated Circuit; Manufacturer_Name: Texas Instruments; Datasheet Link: http://www.ti.com/lit/ds/symlink/iso1540.pdf; Height: 1.75mm; Manufacturer_Part_Number: ISO1540DR; Mouser Part Number: 595-ISO1540DR; Mouser Price/Stock: https://www.mouser.co.uk/ProductDetail/Texas-Instruments/ISO1540DR?qs=rg6Iqu58vpX77upb7ifqqQ%3D%3D; Arrow Part Number: ISO1540DR; Arrow Price/Stock: https://www.arrow.com/en/products/iso1540dr/texas-instruments?region=nac
IC7 = CP2102N-A02-GQFN28R: USB Bridge, USB to UART USB 2.0 UART Interface 28-QFN (5x5); Manufacturer_Name: Silicon Labs; Datasheet Link: https://www.silabs.com/documents/public/data-sheets/cp2102n-datasheet.pdf; Height: 0.8mm; Manufacturer_Part_Number: CP2102N-A02-GQFN28R; Mouser Part Number: 634-CP2102NA02QFN28R; Mouser Price/Stock: https://www.mouser.co.uk/ProductDetail/Silicon-Labs/CP2102N-A02-GQFN28R?qs=u16ybLDytRag4qKvSH3fTw%3D%3D; Arrow Part Number: CP2102N-A02-GQFN28R; Arrow Price/Stock: https://www.arrow.com/en/products/cp2102n-a02-gqfn28r/silicon-labs?utm_currency=USD&region=nac
IC8 IC9 = L8050QLT1G: Integrated Circuit; Manufacturer_Name: LRC; Datasheet Link: https://datasheet.datasheetarchive.com/originals/distributors/Datasheets-28/DSA-558356.pdf; Height: 1.11mm; Manufacturer_Part_Number: L8050QLT1G
IC10 = TLV70233PDBVT: Linear Voltage Regulator IC Positive Fixed 1 Output 300mA SOT-23-5; Manufacturer_Name: Texas Instruments; Datasheet Link: http://www.ti.com/lit/gpn/TLV702P; Height: 1.45mm; Manufacturer_Part_Number: TLV70233PDBVT; Mouser Part Number: 595-TLV70233PDBVT; Mouser Price/Stock: https://www.mouser.co.uk/ProductDetail/Texas-Instruments/TLV70233PDBVT?qs=wrT8kFYR77%252BTqHlKX%252BuSfQ%3D%3D; Arrow Part Number: TLV70233PDBVT; Arrow Price/Stock: https://www.arrow.com/en/products/tlv70233pdbvt/texas-instruments?region=nac
J1 J6 J7 J9 = 455-1706-ND: Connector; Manufacturer_Name: Contact Connectors; Datasheet Link: http://www.jst-mfg.com/product/pdf/eng/ePH.pdf; Height: 4.5mm; Manufacturer_Part_Number: 455-1706-ND
J2 J5 J10 J13-J16 = 1760510000: 2 Position Wire to Board Terminal Block Horizontal with Board 0.200" (5.08mm) Through Hole; Manufacturer_Name: Weidmuller; Datasheet Link: http://catalog.weidmueller.com/createDatasheetForMobile.do?ordernumber=1760510000&scope1=1&scope2=1&localeId=en; Height: 10mm; Manufacturer_Part_Number: 1760510000; Mouser Part Number: 470-1760510000; Mouser Price/Stock: https://www.mouser.co.uk/ProductDetail/Weidmuller/1760510000?qs=BTG2th8YmhTa8qcglSF3eg%3D%3D
J3 J12 J17 J18 = 826926-3: Connector; Manufacturer_Name: TE Connectivity; Datasheet Link: http://uk.rs-online.com/web/p/products/6695310; Height: 9.5mm; Manufacturer_Part_Number: 826926-3; Mouser Part Number: 571-826926-3; Mouser Price/Stock: https://www.mouser.co.uk/ProductDetail/TE-Connectivity/826926-3?qs=wMzmFFBcbXTx9otzu9%252BXNQ%3D%3D; Arrow Part Number: 826926-3; Arrow Price/Stock: https://www.arrow.com/en/products/826926-3/te-connectivity?utm_currency=USD&region=nac
J4 J8 = 1-826629-2: Connector; Manufacturer_Name: TE Connectivity; Datasheet Link: https://www.te.com/commerce/DocumentDelivery/DDEController?Action=srchrtrv&DocNm=826629&DocType=Customer%20Drawing&DocLang=English&PartCntxt=1-826629-2&DocFormat=pdf; Height: 9.7mm; Manufacturer_Part_Number: 1-826629-2; Mouser Part Number: 571-1-826629-2; Mouser Price/Stock: https://www.mouser.co.uk/ProductDetail/TE-Connectivity/1-826629-2?qs=FazuUmncXokmxpv%252BFZO3KQ%3D%3D; Arrow Part Number: 1-826629-2; Arrow Price/Stock: https://www.arrow.com/en/products/1-826629-2/te-connectivity?utm_currency=USD&region=nac
J11 = 68001-206HLF: Connector; Manufacturer_Name: Amphenol; Datasheet Link: https://cdn.amphenol-cs.com/media/wysiwyg/files/drawing/68000.pdf; Height: 8.58mm; Manufacturer_Part_Number: 68001-206HLF; Mouser Part Number: 649-68001-206HLF; Mouser Price/Stock: https://www.mouser.co.uk/ProductDetail/Amphenol-FCI/68001-206HLF?qs=zh4O8xspOuwCLzyjXImWOg%3D%3D
J19 = UJ20-C-V-G-SMT-P16-TR-65: USB Connectors Type C, 2.0, Vertical, Gold Plated 3u, Surface Mount, 16 pin, IP65; Manufacturer_Name: Same Sky; Datasheet Link: https://www.sameskydevices.com/product/resource/UJ20-C-V-G-SMT-P16-TR-65.pdf; Height: 6.1mm; Manufacturer_Part_Number: UJ20-C-V-G-SMT-P16-TR-65; Mouser Part Number: 179-UJ20CVGSMTP16TR6; Mouser Price/Stock: https://www.mouser.co.uk/ProductDetail/Same-Sky/UJ20-C-V-G-SMT-P16-TR-65?qs=IKkN%2F947nfBm4ejY6l33Rw%3D%3D; Arrow Part Number: UJ20-C-V-G-SMT-P16-TR-65; Arrow Price/Stock: https://www.arrow.com/en/products/uj20-c-v-g-smt-p16-tr-65/cui-devices?utm_currency=USD&region=nac
K1-K3 = ACQ131: Relay or Contactor; Manufacturer_Name: Panasonic; Datasheet Link: https://industry.panasonic.com/ac/cdn/e/control/relay/vehicle/catalog/mech_eng_cq.pdf; Height: 16.9mm; Manufacturer_Part_Number: ACQ131; Mouser Part Number: 769-ACQ131; Mouser Price/Stock: https://www.mouser.co.uk/ProductDetail/Panasonic-Industrial-Devices/ACQ131?qs=wKtUvITRiamCgKWaGwgqMg%3D%3D
L1 = LQH43PH3R3M26L: Inductor; Manufacturer_Name: Murata Electronics; Datasheet Link: https://search.murata.co.jp/Ceramy/image/img/P02/JELF243A-9137.pdf; Height: 2.8mm; Manufacturer_Part_Number: LQH43PH3R3M26L; Mouser Part Number: 81-LQH43PH3R3M26L; Mouser Price/Stock: https://www.mouser.com/Search/Refine.aspx?Keyword=81-LQH43PH3R3M26L
L2 = XAL5050-223MEC: Inductor; Manufacturer_Name: COILCRAFT; Datasheet Link: https://www.coilcraft.com/getmedia/49bc46c8-4b2c-45b9-9b6c-2eaa235ea698/xal50xx.pdf; Manufacturer_Part_Number: XAL5050-223MEC; Mouser Part Number: 994-XAL5050-223MEC; Mouser Price/Stock: https://www.mouser.co.uk/ProductDetail/Coilcraft/XAL5050-223MEC?qs=zCSbvcPd3pZDBbGj4RTtgg%3D%3D
LED1-LED3 = HSMF-C163: LED; Manufacturer_Name: Avago Technologies; Datasheet Link: https://docs.broadcom.com/doc/AV02-0584EN; Height: 0.6mm; Manufacturer_Part_Number: HSMF-C163; Mouser Part Number: 630-HSMF-C163; Mouser Price/Stock: https://www.mouser.co.uk/ProductDetail/Broadcom-Avago/HSMF-C163?qs=9%2FrGSQZ%252BqoguqyXeqgCncw%3D%3D
PS1 = RB-3.33.3S: 1W DC/DC-Converter 'ECONOLINE' SIP7 1kV unreg; MF: Recom Power; SnapEDA_Link: https://www.snapeda.com/parts/RB-3.33.3S/Recom+Power/view-part/?ref=snap; Package: SIP-7 Recom Power; Value: *; MP: RB-3.33.3S; Check_prices: https://www.snapeda.com/parts/RB-3.33.3S/Recom+Power/view-part/?ref=eda
Q1 Q3 Q4 = DI13001: Transistor BJT NPN; Manufacturer_Name: Diotec; Datasheet Link: https://www.mouser.ch/datasheet/2/849/di13001-3324059.pdf; Height: 1.1mm; Manufacturer_Part_Number: DI13001; Mouser Part Number: 637-DI13001; Mouser Price/Stock: https://www.mouser.co.uk/ProductDetail/Diotec-Semiconductor/DI13001?qs=Wj%2FVkw3K%252BMBo954qDLQwqg%3D%3D
Q2 = FQD8P10TM-F085: MOSFET (P-Channel); Manufacturer_Name: onsemi; Datasheet Link: https://www.onsemi.com/pub/Collateral/FQD8P10TM_F085-D.PDF; Height: 2.399mm; Manufacturer_Part_Number: FQD8P10TM-F085; Mouser Part Number: 512-FQD8P10TM_F085; Mouser Price/Stock: https://www.mouser.co.uk/ProductDetail/onsemi-Fairchild/FQD8P10TM-F085?qs=0lQeLiL1qyakMKmcxY59wg%3D%3D; Arrow Part Number: FQD8P10TM-F085; Arrow Price/Stock: https://www.arrow.com/en/products/fqd8p10tm-f085/on-semiconductor?utm_currency=USD&region=nac
Q5 = PC817X1CSP9F: Phototransistor; Manufacturer_Name: Sharp Microelectronics; Datasheet Link: https://www.lcsc.com/product-detail/Optocouplers-Phototransistor-Output_Sharp-Microelectronics-PC817X1CSP9F_C97308.html; Height: 4.36mm; Manufacturer_Part_Number: PC817X1CSP9F; Mouser Part Number: 852-PC817X1CSP9F; Mouser Price/Stock: https://www.mouser.co.uk/ProductDetail/Sharp-Microelectronics/PC817X1CSP9F?qs=rrS6PyfT74f%252BaIhOIosJzQ%3D%3D
R1 R3 R5 R6 R11 R14 R19 R30 = ERJ-2RKF1001X: Thick Film Resistors - SMD 0402 1Kohms 1% AEC-Q200; Manufacturer_Name: Panasonic; Datasheet Link: https://industrial.panasonic.com/cdbs/www-data/pdf/RDA0000/AOA0000C86.pdf; Height: 0.4mm; Manufacturer_Part_Number: ERJ-2RKF1001X; Mouser Part Number: 667-ERJ-2RKF1001X; Mouser Price/Stock: https://www.mouser.co.uk/ProductDetail/Panasonic/ERJ-2RKF1001X?qs=H7k1u0Mp9JRRg22R5LYj9Q%3D%3D; Arrow Part Number: ERJ-2RKF1001X; Arrow Price/Stock: https://www.arrow.com/en/products/erj-2rkf1001x/panasonic?region=nac
R2 R4 R7 R12 = ERJ-PA2F2001X: Thick Film Resistors - SMD 0402 1%2Kohm; Manufacturer_Name: Panasonic; Datasheet Link: http://industrial.panasonic.com/cdbs/www-data/pdf/RDO0000/AOA0000C331.pdf; Height: 0.4mm; Manufacturer_Part_Number: ERJ-PA2F2001X; Mouser Part Number: 667-ERJ-PA2F2001X; Mouser Price/Stock: https://www.mouser.co.uk/ProductDetail/Panasonic/ERJ-PA2F2001X?qs=V%252BBODeGd91LwTfJnSXtZGg%3D%3D
R8 R10 R16 R17 R20 R21 = RCS0805470RJNEA: Resistor; Manufacturer_Name: Vishay; Datasheet Link: https://componentsearchengine.com/Datasheets/1/RCS0805470RJNEA.pdf; Height: 0.5mm; Manufacturer_Part_Number: RCS0805470RJNEA; Mouser Part Number: 71-RCS0805470RJNEA; Mouser Price/Stock: https://www.mouser.co.uk/ProductDetail/Vishay-Dale/RCS0805470RJNEA?qs=NKmfXavxMawp2y0h5Y47sg%3D%3D
R9 = RT0805FRE1010KL: Resistor; Manufacturer_Name: YAGEO; Datasheet Link: https://www.mouser.com/datasheet/2/447/PYu_RT_1_to_0_01_RoHS_L_12-3003070.pdf; Height: 0.6mm; Manufacturer_Part_Number: RT0805FRE1010KL; Mouser Part Number: 603-RT0805FRE1010KL; Mouser Price/Stock: https://www.mouser.co.uk/ProductDetail/YAGEO/RT0805FRE1010KL?qs=F5EMLAvA7IDXJrrkpAsXTw%3D%3D
R13 = ERJ-S030R00V: Thick Film Resistors 0603 Zero ohm Jumper 0.05ohm AEC-Q200; Manufacturer_Name: Panasonic; Datasheet Link: https://industrial.panasonic.com/cdbs/www-data/pdf/RDP0000/AOA0000C334.pdf; Height: 0.55mm; Manufacturer_Part_Number: ERJ-S030R00V; Mouser Part Number: 667-ERJ-S030R00V; Mouser Price/Stock: https://www.mouser.co.uk/ProductDetail/Panasonic/ERJ-S030R00V?qs=Zyl8A9hlmJoXhSwWJ1aTPA%3D%3D; Arrow Part Number: ERJ-S030R00V; Arrow Price/Stock: https://www.arrow.com/en/products/erj-s030r00v/panasonic?region=nac
R15 R25 R27 = AC0402FR-070RL: Thick Film Resistors - SMD 0 Ohms 1/16 W 50 V 1% 0402 - 55 C + 155 C AEC-Q200; Manufacturer_Name: KEMET; Datasheet Link: https://www.arrow.com/en/products/ac0402fr-070rl/yageo; Height: 0.37mm; Manufacturer_Part_Number: AC0402FR-070RL; Mouser Part Number: 603-AC0402FR-070RL; Mouser Price/Stock: https://www.mouser.co.uk/ProductDetail/Yageo/AC0402FR-070RL/?qs=ygRr%2FtkhtettkzGxq5kFaA%3D%3D; Arrow Part Number: AC0402FR-070RL; Arrow Price/Stock: https://www.arrow.com/en/products/ac0402fr-070rl/yageo
R18 R24 R26 R33 = ERJ-3EKF1002V: Thick Film Resistors - SMD 0603 10Kohms 1% AEC-Q200; Manufacturer_Name: Panasonic; Datasheet Link: http://industrial.panasonic.com/cdbs/www-data/pdf/RDA0000/AOA0000C86.pdf; Height: 0.55mm; Manufacturer_Part_Number: ERJ-3EKF1002V; Mouser Part Number: 667-ERJ-3EKF1002V; Mouser Price/Stock: https://www.mouser.co.uk/ProductDetail/Panasonic/ERJ-3EKF1002V?qs=H7k1u0Mp9JSrGPQ5%2F5COuw%3D%3D; Arrow Part Number: ERJ-3EKF1002V; Arrow Price/Stock: https://www.arrow.com/en/products/erj-3ekf1002v/panasonic?utm_currency=USD&region=nac
R22 R28 = CRCW121015K0FKEAHP: Resistor; Manufacturer_Name: Vishay; Height: 0.7mm; Manufacturer_Part_Number: CRCW121015K0FKEAHP; Mouser Part Number: 71-CRCW121015K0FKEAH; Mouser Price/Stock: https://www.mouser.co.uk/ProductDetail/Vishay-Dale/CRCW121015K0FKEAHP?qs=OAzHGkhREL1RoHm7C%252B4QTg%3D%3D; Arrow Part Number: CRCW121015K0FKEAHP; Arrow Price/Stock: https://www.arrow.com/en/products/crcw121015k0fkeahp/vishay?utm_currency=USD&region=nac
R23 R32 = CRCW1210100KFKEAHP: Resistor; Manufacturer_Name: Vishay; Datasheet Link: http://componentsearchengine.com/Datasheets/1/CRCW1210100KFKEAHP.pdf; Height: 0.7mm; Manufacturer_Part_Number: CRCW1210100KFKEAHP; Mouser Part Number: 71-CRCW1210100KFKEAH; Mouser Price/Stock: https://www.mouser.co.uk/ProductDetail/Vishay-Dale/CRCW1210100KFKEAHP?qs=OAzHGkhREL394hpx0laG8g%3D%3D; Arrow Part Number: CRCW1210100KFKEAHP; Arrow Price/Stock: https://www.arrow.com/en/products/crcw1210100kfkeahp/vishay?region=nac
R29 = ERJ-PA3F2212V: Thick Film Resistors - SMD 0603 22.1Kohm 1% Anti-Surge AEC-Q200; Manufacturer_Name: Panasonic; Datasheet Link: https://industrial.panasonic.com/cdbs/www-data/pdf/RDO0000/AOA0000C331.pdf; Height: 0.55mm; Manufacturer_Part_Number: ERJ-PA3F2212V; Mouser Part Number: 667-ERJ-PA3F2212V; Mouser Price/Stock: https://www.mouser.co.uk/ProductDetail/Panasonic/ERJ-PA3F2212V?qs=BzJM0faLVqU03B5Hj9uKMg%3D%3D; Arrow Part Number: ERJ-PA3F2212V; Arrow Price/Stock: https://www.arrow.com/en/products/erj-pa3f2212v/panasonic
R31 = ERJ-1GJF4752C: Thick Film Resistors - SMD 0201 0.05W 1% 47.5KOhm AEC-Q200; Manufacturer_Name: Panasonic; Datasheet Link: https://industrial.panasonic.com/cdbs/www-data/pdf/RDA0000/AOA0000C304.pdf; Height: 0.26mm; Manufacturer_Part_Number: ERJ-1GJF4752C
R34 = LTR50UZPF3301: Resistor; Manufacturer_Name: ROHM Semiconductor; Datasheet Link: https://www.mouser.com/datasheet/2/348/ltr_e-1139145.pdf; Height: 0.65mm; Manufacturer_Part_Number: LTR50UZPF3301; Mouser Part Number: 755-LTR50UZPF3301; Mouser Price/Stock: https://www.mouser.co.uk/ProductDetail/ROHM-Semiconductor/LTR50UZPF3301?qs=493kPxzlxfJ2Oa7JQxx0gA%3D%3D
S1 S2 = NTC013-AT1J-A160T: Switch; Manufacturer_Name: N&H Technology; Datasheet Link: https://www.nh-technology.de/T-Mec/PDF/Series_TC/NTC013.pdf; Height: 2.7mm; Manufacturer_Part_Number: NTC013-AT1J-A160T
Y1 = 830030798: Crystal or Oscillator; Manufacturer_Name: Wurth Elektronik; Datasheet Link: https://www.we-online.com/catalog/datasheet/830030798.pdf; Height: 4.5mm; Manufacturer_Part_Number: 830030798; Mouser Part Number: 710-830030798; Mouser Price/Stock: https://www.mouser.co.uk/ProductDetail/Wurth-Elektronik/830030798?qs=2WXlatMagcFkpjBrIzHPEQ%3D%3D
Z1-Z4 = PTZTFTE2515B: Zener Diode; Manufacturer_Name: ROHM Semiconductor; Datasheet Link: https://fscdn.rohm.com/en/products/databook/datasheet/discrete/diode/zener/ptztfte2515b-e.pdf; Height: 2.2mm; Manufacturer_Part_Number: PTZTFTE2515B; Mouser Part Number: 755-PTZTFTE2515B; Mouser Price/Stock: https://www.mouser.co.uk/ProductDetail/ROHM-Semiconductor/PTZTFTE2515B?qs=4v%252BiZTmLVHGQdTFaf9B3oQ%3D%3D